# Altium project GameBoard_V1I1.PrjPcb (part 3 of 20)

## Sheet [08] - CPU - SPI, UART.SchDoc
size A2; DocumentNumber: 8; SheetNumber: 8; SheetTotal: 32
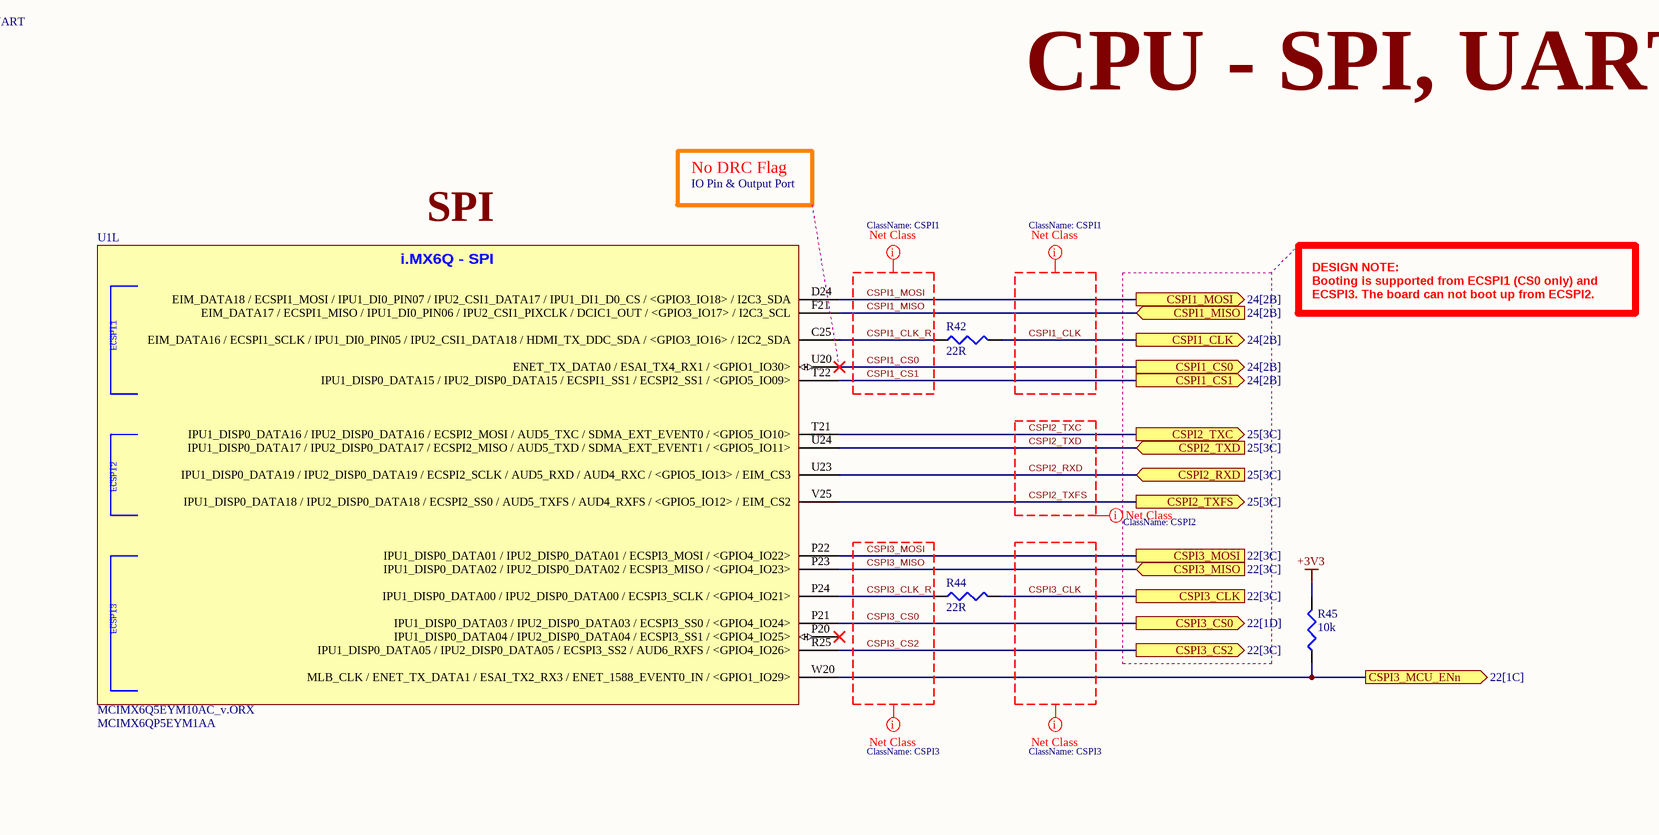
[diagram p16: [08] - CPU - SPI, UART.SchDoc, top left]
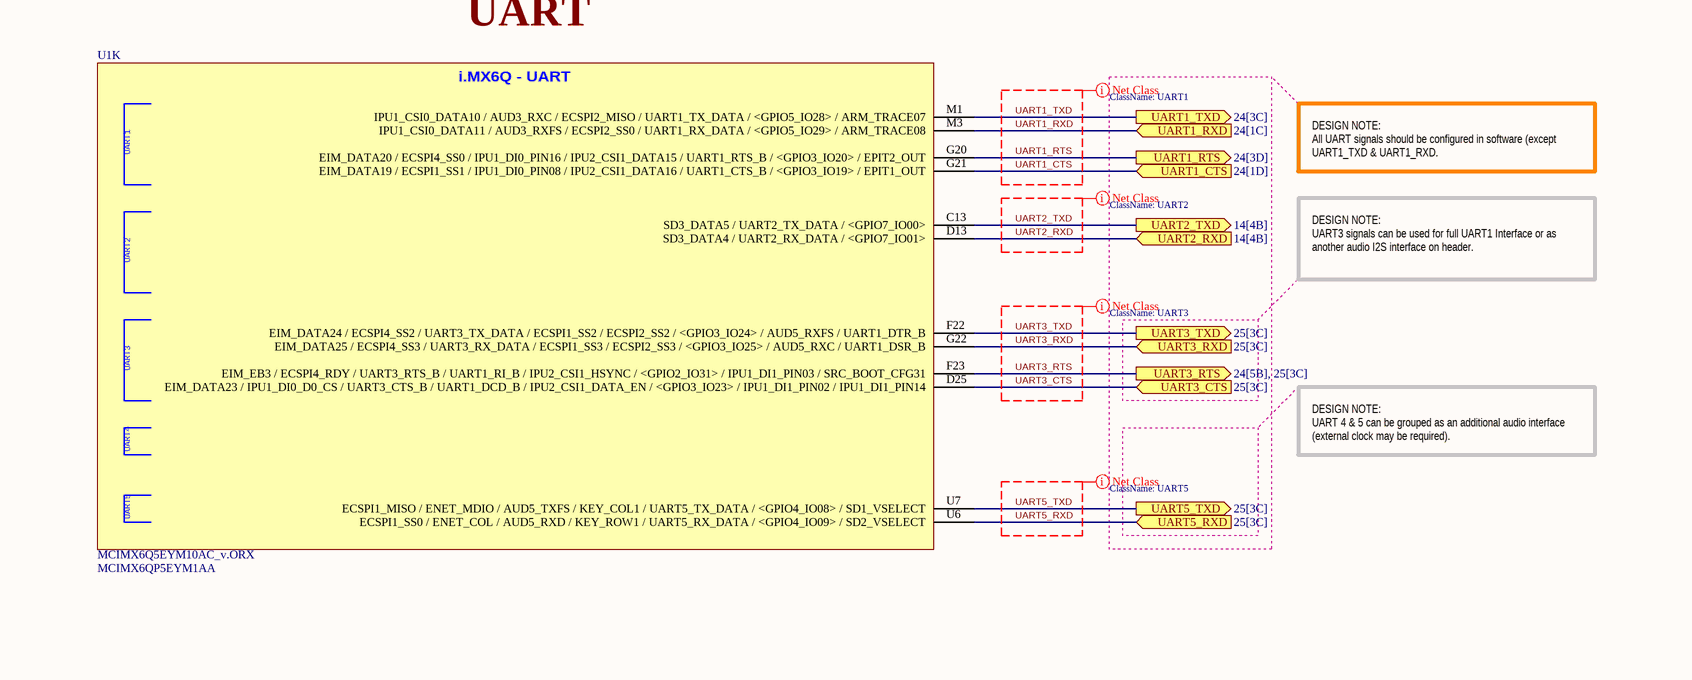
[diagram p17: [08] - CPU - SPI, UART.SchDoc, bottom left]
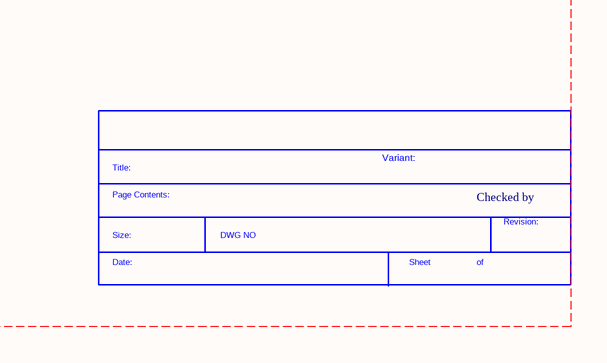
[diagram p18: [08] - CPU - SPI, UART.SchDoc, bottom right]

### Parts
(Parts that share a designator on the sheet are numbered #1, #2 ... from top to bottom, then left to right.)
*#8  SDTitleBlock  (value not drawn)  (graphical)
R42  22R  [R0402]
R44  22R  [R0402]
R45  10k  [R0402]
U1  MCIMX6Q5EYM10AC_v.ORX  Supplier Part Number 2: MCIMX6QP5EYM1AA  [PBGA624]  (parts K,L of 23)

### Ports
CSPI1_CLK (out, see 24[2B]), CSPI1_CS0 (out, see 24[2B]), CSPI1_CS1 (out, see 24[2B]), CSPI1_MISO (in, see 24[2B]), CSPI1_MOSI (out, see 24[2B]), CSPI2_RXD (in, see 25[3C]), CSPI2_TXC (out, see 25[3C]), CSPI2_TXD (in, see 25[3C]), CSPI2_TXFS (out, see 25[3C]), CSPI3_CLK (see 22[3C]), CSPI3_CS0 (out, see 22[1D]), CSPI3_CS2 (out, see 22[3C]), CSPI3_MCU_ENn (out, see 22[1C]), CSPI3_MISO (in, see 22[3C]), CSPI3_MOSI (see 22[3C]), UART1_CTS (in, see 24[1D]), UART1_RTS (out, see 24[3D]), UART1_RXD (in, see 24[1C]), UART1_TXD (out, see 24[3C]), UART2_RXD (in, see 14[4B]), UART2_TXD (out, see 14[4B]), UART3_CTS (in, see 25[3C]), UART3_RTS (out, see 24[5B], 25[3C]), UART3_RXD (in, see 25[3C]), UART3_TXD (out, see 25[3C]), UART5_RXD (in, see 25[3C]), UART5_TXD (out, see 25[3C])

### Nets
+3V3: R45.2
CSPI1_CLK: R42.2 ; port CSPI1_CLK
CSPI1_CLK_R: R42.1 U1.C25(EIM_DATA16_/_ECSPI1_SCLK_/_IPU1_DI0_PIN05_/_IPU2_CSI1_DATA18_/_HDMI_TX_DDC_SDA_/_<GPIO3_IO16>_/_I2C2_SDA)
CSPI1_CS0: U1.U20(ENET_TX_DATA0_/_ESAI_TX4_RX1_/_<GPIO1_IO30>) ; port CSPI1_CS0
CSPI1_CS1: U1.T22(IPU1_DISP0_DATA15_/_IPU2_DISP0_DATA15_/_ECSPI1_SS1_/_ECSPI2_SS1_/_<GPIO5_IO09>) ; port CSPI1_CS1
CSPI1_MISO: U1.F21(EIM_DATA17_/_ECSPI1_MISO_/_IPU1_DI0_PIN06_/_IPU2_CSI1_PIXCLK_/_DCIC1_OUT_/_<GPIO3_IO17>_/_I2C3_SCL) ; port CSPI1_MISO
CSPI1_MOSI: U1.D24(EIM_DATA18_/_ECSPI1_MOSI_/_IPU1_DI0_PIN07_/_IPU2_CSI1_DATA17_/_IPU1_DI1_D0_CS_/_<GPIO3_IO18>_/_I2C3_SDA) ; port CSPI1_MOSI
CSPI2_RXD: U1.U23(IPU1_DISP0_DATA19_/_IPU2_DISP0_DATA19_/_ECSPI2_SCLK_/_AUD5_RXD_/_AUD4_RXC_/_<GPIO5_IO13>_/_EIM_CS3) ; port CSPI2_RXD
CSPI2_TXC: U1.T21(IPU1_DISP0_DATA16_/_IPU2_DISP0_DATA16_/_ECSPI2_MOSI_/_AUD5_TXC_/_SDMA_EXT_EVENT0_/_<GPIO5_IO10>) ; port CSPI2_TXC
CSPI2_TXD: U1.U24(IPU1_DISP0_DATA17_/_IPU2_DISP0_DATA17_/_ECSPI2_MISO_/_AUD5_TXD_/_SDMA_EXT_EVENT1_/_<GPIO5_IO11>) ; port CSPI2_TXD
CSPI2_TXFS: U1.V25(IPU1_DISP0_DATA18_/_IPU2_DISP0_DATA18_/_ECSPI2_SS0_/_AUD5_TXFS_/_AUD4_RXFS_/_<GPIO5_IO12>_/_EIM_CS2) ; port CSPI2_TXFS
CSPI3_CLK: R44.2 ; port CSPI3_CLK
CSPI3_CLK_R: R44.1 U1.P24(IPU1_DISP0_DATA00_/_IPU2_DISP0_DATA00_/_ECSPI3_SCLK_/_<GPIO4_IO21>)
CSPI3_CS0: U1.P21(IPU1_DISP0_DATA03_/_IPU2_DISP0_DATA03_/_ECSPI3_SS0_/_<GPIO4_IO24>) ; port CSPI3_CS0
CSPI3_CS2: U1.R25(IPU1_DISP0_DATA05_/_IPU2_DISP0_DATA05_/_ECSPI3_SS2_/_AUD6_RXFS_/_<GPIO4_IO26>) ; port CSPI3_CS2
CSPI3_MCU_ENn: R45.1 U1.W20(MLB_CLK_/_ENET_TX_DATA1_/_ESAI_TX2_RX3_/_ENET_1588_EVENT0_IN_/_<GPIO1_IO29>) ; port CSPI3_MCU_ENn
CSPI3_MISO: U1.P23(IPU1_DISP0_DATA02_/_IPU2_DISP0_DATA02_/_ECSPI3_MISO_/_<GPIO4_IO23>) ; port CSPI3_MISO
CSPI3_MOSI: U1.P22(IPU1_DISP0_DATA01_/_IPU2_DISP0_DATA01_/_ECSPI3_MOSI_/_<GPIO4_IO22>) ; port CSPI3_MOSI
UART1_CTS: U1.G21(EIM_DATA19_/_ECSPI1_SS1_/_IPU1_DI0_PIN08_/_IPU2_CSI1_DATA16_/_UART1_CTS_B_/_<GPIO3_IO19>_/_EPIT1_OUT) ; port UART1_CTS
UART1_RTS: U1.G20(EIM_DATA20_/_ECSPI4_SS0_/_IPU1_DI0_PIN16_/_IPU2_CSI1_DATA15_/_UART1_RTS_B_/_<GPIO3_IO20>_/_EPIT2_OUT) ; port UART1_RTS
UART1_RXD: U1.M3(IPU1_CSI0_DATA11_/_AUD3_RXFS_/_ECSPI2_SS0_/_UART1_RX_DATA_/_<GPIO5_IO29>_/_ARM_TRACE08) ; port UART1_RXD
UART1_TXD: U1.M1(IPU1_CSI0_DATA10_/_AUD3_RXC_/_ECSPI2_MISO_/_UART1_TX_DATA_/_<GPIO5_IO28>_/_ARM_TRACE07) ; port UART1_TXD
UART2_RXD: U1.D13(SD3_DATA4_/_UART2_RX_DATA_/_<GPIO7_IO01>) ; port UART2_RXD
UART2_TXD: U1.C13(SD3_DATA5_/_UART2_TX_DATA_/_<GPIO7_IO00>) ; port UART2_TXD
UART3_CTS: U1.D25(EIM_DATA23_/_IPU1_DI0_D0_CS_/_UART3_CTS_B_/_UART1_DCD_B_/_IPU2_CSI1_DATA_EN_/_<GPIO3_IO23>_/_IPU1_DI1_PIN02_/_IPU1_DI1_PIN14) ; port UART3_CTS
UART3_RTS: U1.F23(EIM_EB3_/_ECSPI4_RDY_/_UART3_RTS_B_/_UART1_RI_B_/_IPU2_CSI1_HSYNC_/_<GPIO2_IO31>_/_IPU1_DI1_PIN03_/_SRC_BOOT_CFG31) ; port UART3_RTS
UART3_RXD: U1.G22(EIM_DATA25_/_ECSPI4_SS3_/_UART3_RX_DATA_/_ECSPI1_SS3_/_ECSPI2_SS3_/_<GPIO3_IO25>_/_AUD5_RXC_/_UART1_DSR_B) ; port UART3_RXD
UART3_TXD: U1.F22(EIM_DATA24_/_ECSPI4_SS2_/_UART3_TX_DATA_/_ECSPI1_SS2_/_ECSPI2_SS2_/_<GPIO3_IO24>_/_AUD5_RXFS_/_UART1_DTR_B) ; port UART3_TXD
UART5_RXD: U1.U6(ECSPI1_SS0_/_ENET_COL_/_AUD5_RXD_/_KEY_ROW1_/_UART5_RX_DATA_/_<GPIO4_IO09>_/_SD2_VSELECT) ; port UART5_RXD
UART5_TXD: U1.U7(ECSPI1_MISO_/_ENET_MDIO_/_AUD5_TXFS_/_KEY_COL1_/_UART5_TX_DATA_/_<GPIO4_IO08>_/_SD1_VSELECT) ; port UART5_TXD

Not connected (* = marked no-connect by the designer): U1 P20(IPU1_DISP0_DATA04_/_IPU2_DISP0_DATA04_/_ECSPI3_SS1_/_<GPIO4_IO25>)*

### Layout directives
net class UART1: UART1_CTS, UART1_RTS, UART1_RXD, UART1_TXD
net class CSPI1: CSPI1_CLK, CSPI1_CLK_R, CSPI1_CS0, CSPI1_CS1, CSPI1_MISO, CSPI1_MOSI
net class CSPI3: CSPI3_CLK, CSPI3_CLK_R, CSPI3_CS0, CSPI3_CS2, CSPI3_MISO, CSPI3_MOSI
net class UART3: UART3_CTS, UART3_RTS, UART3_RXD, UART3_TXD
net class CSPI2: CSPI2_RXD, CSPI2_TXC, CSPI2_TXD, CSPI2_TXFS
net class UART5: UART5_RXD, UART5_TXD
net class UART2: UART2_RXD, UART2_TXD
net class [08] - CPU - SPI/UART: +3V3, CSPI1_CLK, CSPI1_CLK_R, CSPI1_CS0, CSPI1_CS1, CSPI1_MISO, CSPI1_MOSI, CSPI2_RXD, CSPI2_TXC, CSPI2_TXD, CSPI2_TXFS, CSPI3_CLK, CSPI3_CLK_R, CSPI3_CS0, CSPI3_CS2, CSPI3_MISO, CSPI3_MOSI, UART1_CTS, UART1_RTS, UART1_RXD, UART1_TXD, UART2_RXD, UART2_TXD, UART3_CTS, UART3_RTS, UART3_RXD, UART3_TXD, UART5_RXD, UART5_TXD

### Notes on the sheet
- CPU - SPI, UART
- No DRC Flag
- IO Pin & Output Port
- SPI
- DESIGN NOTE:
  Booting is supported from ECSPI1 (CS0 only) and ECSPI3. The board can not boot up from ECSPI2.
- UART
- DESIGN NOTE:
  All UART signals should be configured in software (except UART1_TXD & UART1_RXD.
- DESIGN NOTE:
  UART3 signals can be used for full UART1 Interface or as another audio I2S interface on header.
- DESIGN NOTE:
  UART 4 & 5 can be grouped as an additional audio interface (external clock may be required).
- Variant:
- Checked by
- (in symbol MCIMX6Q5EYM10AC_v.ORX, part K) i.MX6Q - UART; UART1; UART2; UART3; UART4; UART5
- (in symbol MCIMX6Q5EYM10AC_v.ORX, part L) i.MX6Q - SPI; ECSPI1; ECSPI2; ECSPI3
- (in symbol SDTitleBlock) Title:; Page Contents:; Revision:; Size:; DWG NO; Date:; Sheet; of

### Library data of the parts
R42 R44 = RC0402FR-0722RL: RES 22.0 OHM 1/16W 1% 0402 SMD; Manufacturer: Yageo; Resistance (Ohms): 22; Power (Watts): 0.063W, 1/16W; .Checked PCB: used; Temperature Coefficient: ±100ppm/°C; Category: Resistors; Supplier Part Number: 311-22.0LRCT-ND; Manufacturer Part Number: RC0402FR-0722RL; Package / Case: 0402 (1005 Metric); Price 1k [$]: 0.01421; Tolerance: ±1%; Value: 22R; .Checked SCH: used; Supplier: Digikey; Supplier 1: Digi-Key; Supplier Part Number 1: 311-22.0LRCT-ND; RoHS: RoHS Compliant; Stock 1: 943800; Pricing 1: 10=0.014, 50=0.0104, 100=0.0079, 250=0.00584, 500=0.00432, 1000=0.00288 (USD); Composition: Thick Film; Features: -; Size / Dimension: 0.039" L x 0.020" W (1.00mm x 0.50mm); Height: 0.016" (0.40mm); Number of Terminations: 2; Packaging: Cut Tape (CT); ComponentLink1URL: http://www.yageo.com/documents/recent/PYu-RC0402_51_RoHS_L_6.pdf; ComponentLink1Description: http://www.yageo.com/documents/recent/PYu-RC0402_51_RoHS_L_6.pdf
R45 = RC0402FR-0710KL: RES 10.0K OHM 1/16W 1% 0402 SMD; Manufacturer: Yageo; Power (Watts): 0.063W, 1/16W; .Checked PCB: used; Temperature Coefficient: ±100ppm/°C; Category: Resistors; Supplier Part Number: 311-10.0KLRCT-ND; Manufacturer Part Number: RC0402FR-0710KL; Package / Case: 0402 (1005 Metric); Price 1k [$]: 0.01421; Resistance (Ohms): 10K; Tolerance: ±1%; Value: 10k; .Checked SCH: used; Supplier: Digikey; Supplier 1: Digi-Key; Supplier Part Number 1: 311-10.0KLRCT-ND; RoHS: RoHS Compliant; Stock 1: 2916495; Pricing 1: 10=0.014, 50=0.0104, 100=0.0079, 250=0.00584, 500=0.00432, 1000=0.00288 (USD); Composition: Thick Film; Features: -; Size / Dimension: 0.039" L x 0.020" W (1.00mm x 0.50mm); Height: 0.016" (0.40mm); Number of Terminations: 2; Packaging: Cut Tape (CT); ComponentLink1URL: http://www.yageo.com/documents/recent/PYu-RC0402_51_RoHS_L_6.pdf; ComponentLink1Description: http://www.yageo.com/documents/recent/PYu-RC0402_51_RoHS_L_6.pdf
U1 = MCIMX6Q5EYM10AC_v.ORX: IC MCU 32BIT ARM QUAD 624FCBGA; Manufacturer: Freescale Semiconductor; Core Processor: ARM® Cortex™-A9; Core Size: 32-Bit Quad-Core; Speed: 1.0GHz; Connectivity: CAN, EBI/EMI, ESAI, Ethernet, GPMI, I2C, MMC/SD, PCI, SATA, SPI, UART, USB, USB OTG; Peripherals: DMA, HDMI, I2S/SSI/AC97, MIPI CSI, MIMI DSI, MIPI HIS, PWM, WDT; Number of I /O: 224; Program Memory Type: External Program Memory; RAM Size: 256K x 8; Voltage - Supply (Vcc/Vdd): 0.925 V ~ 1.5 V; Oscillator Type: Internal; .Creator: MM; .Checked PCB: used; Supplier 1: Digi-Key; Manufacturer Part Number: MCIMX6Q5EYM10AC; RoHS: RoHS Compliant; Category: Integrated Circuits (ICs); Stock 1: 0; Pricing 1: 1=54.98, 10=51.922, 25=48.868, 100=30.5424 (USD); Program Memory Size: -; EEPROM Size: -; Data Converters: -; Operating Temperature: -20°C ~ 105°C; Package / Case: 624-FBGA, FCBGA; Packaging: Tray; ComponentLink1URL: http://cache.freescale.com/files/32bit/doc/data_sheet/IMX6DQCEC.pdf; ComponentLink1Description: Data Sheet; Supplier Part Number 1: MCIMX6Q5EYM10AC-ND; .Checked SCH: used; ComponentLink2Description: User Guide; ComponentLink2URL: file:///C:/Users/mbeach/Downloads/i.MX_Linux_User's_Guide.pdf; Supplier 2: Arrow

## Sheet [10] - CPU - GPIO, PWM, LEDS, BUTTONS.SchDoc
size A2; DocumentNumber: 10; SheetNumber: 10; SheetTotal: 32
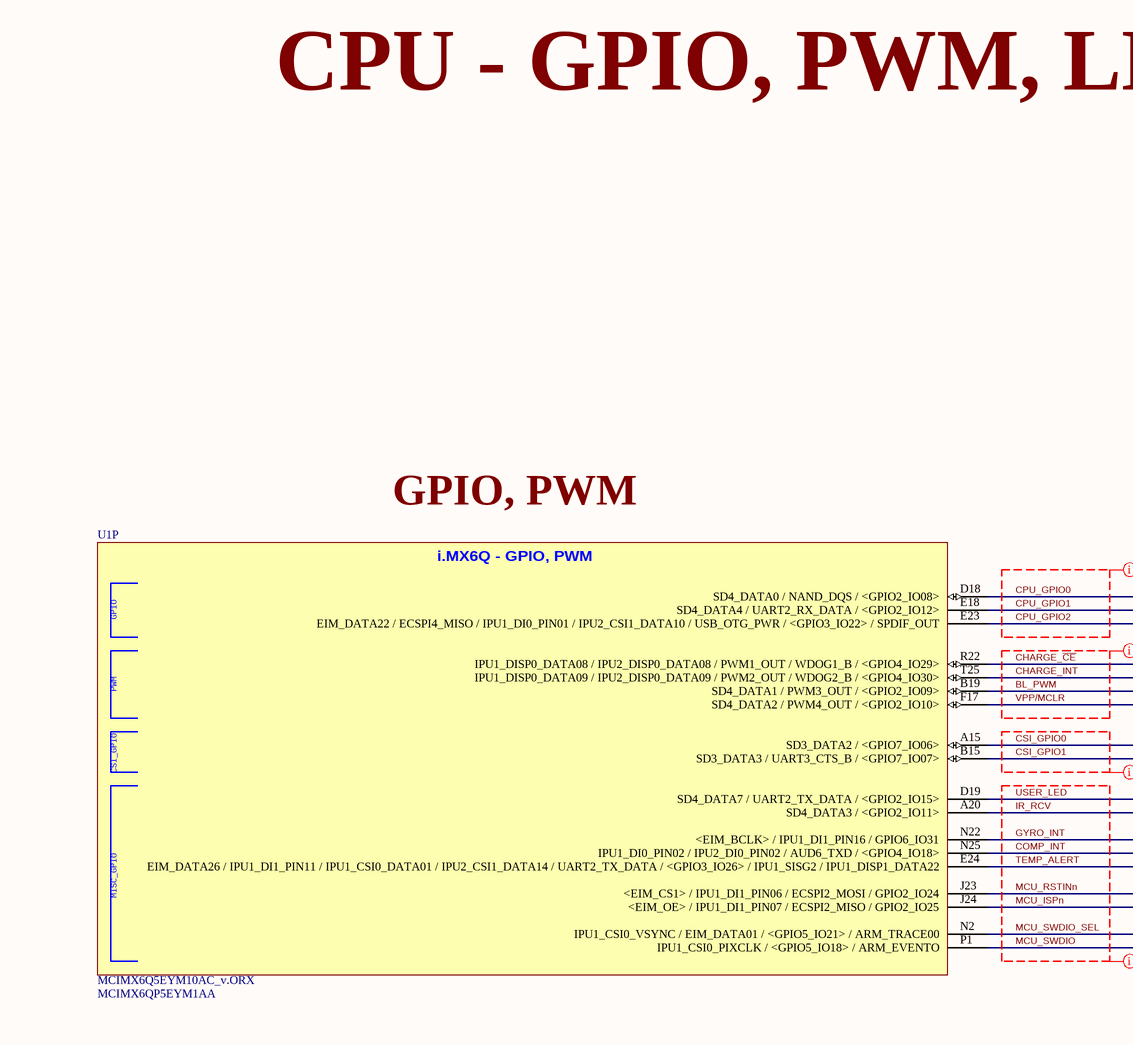
[diagram p19: [10] - CPU - GPIO, PWM, LEDS, BUTTONS.SchDoc, top left]
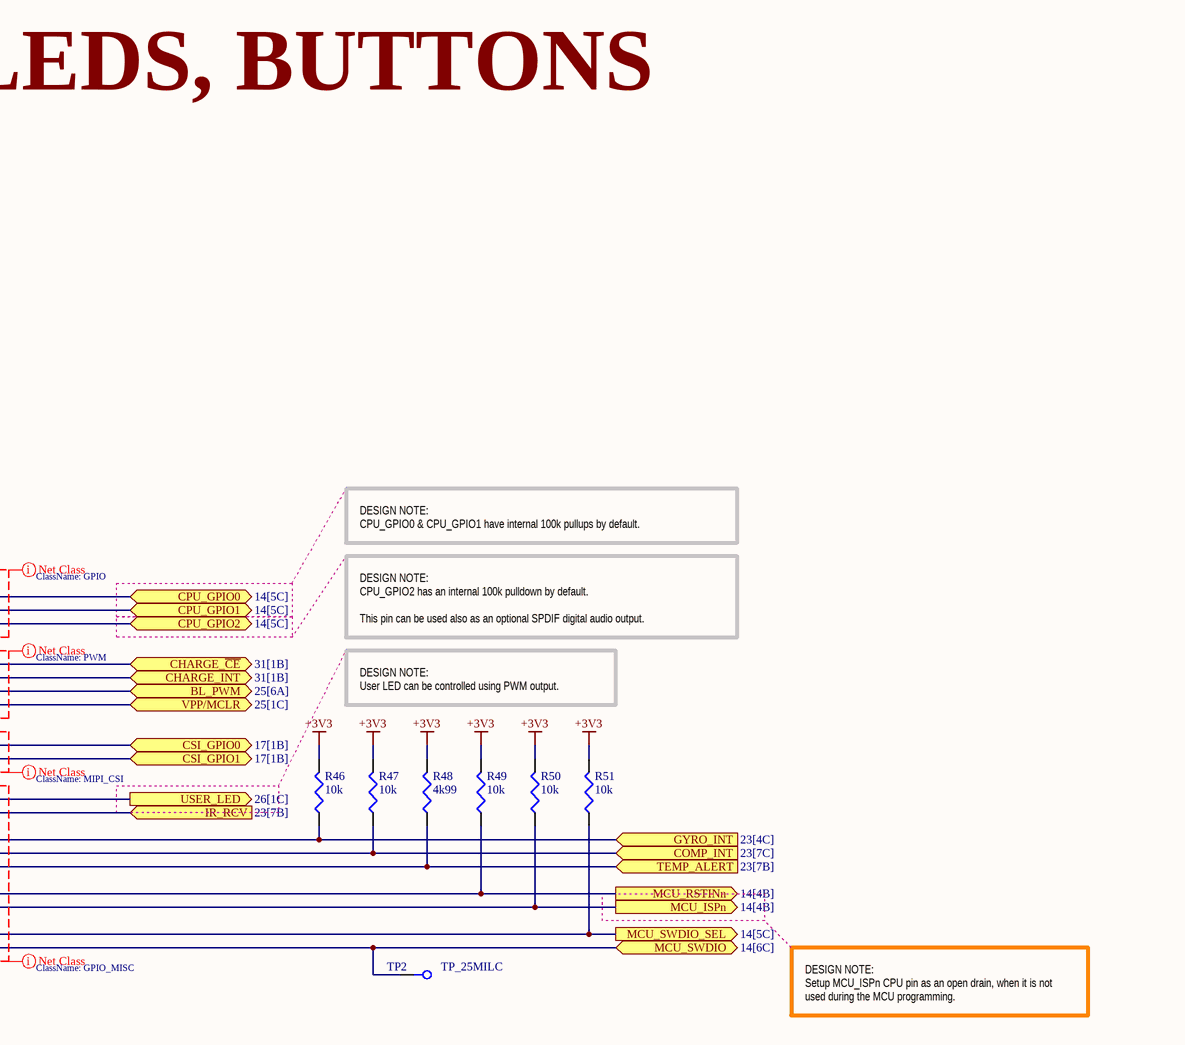
[diagram p20: [10] - CPU - GPIO, PWM, LEDS, BUTTONS.SchDoc, top right]
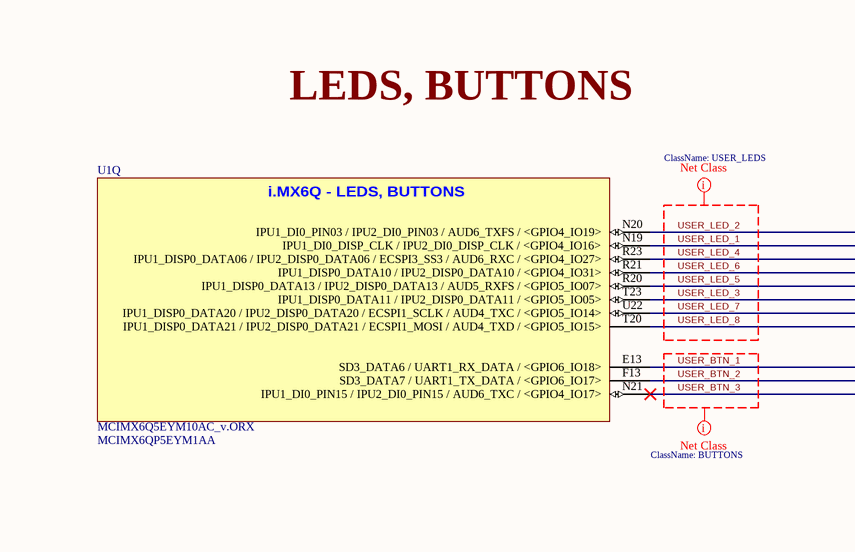
[diagram p21: [10] - CPU - GPIO, PWM, LEDS, BUTTONS.SchDoc, bottom left]
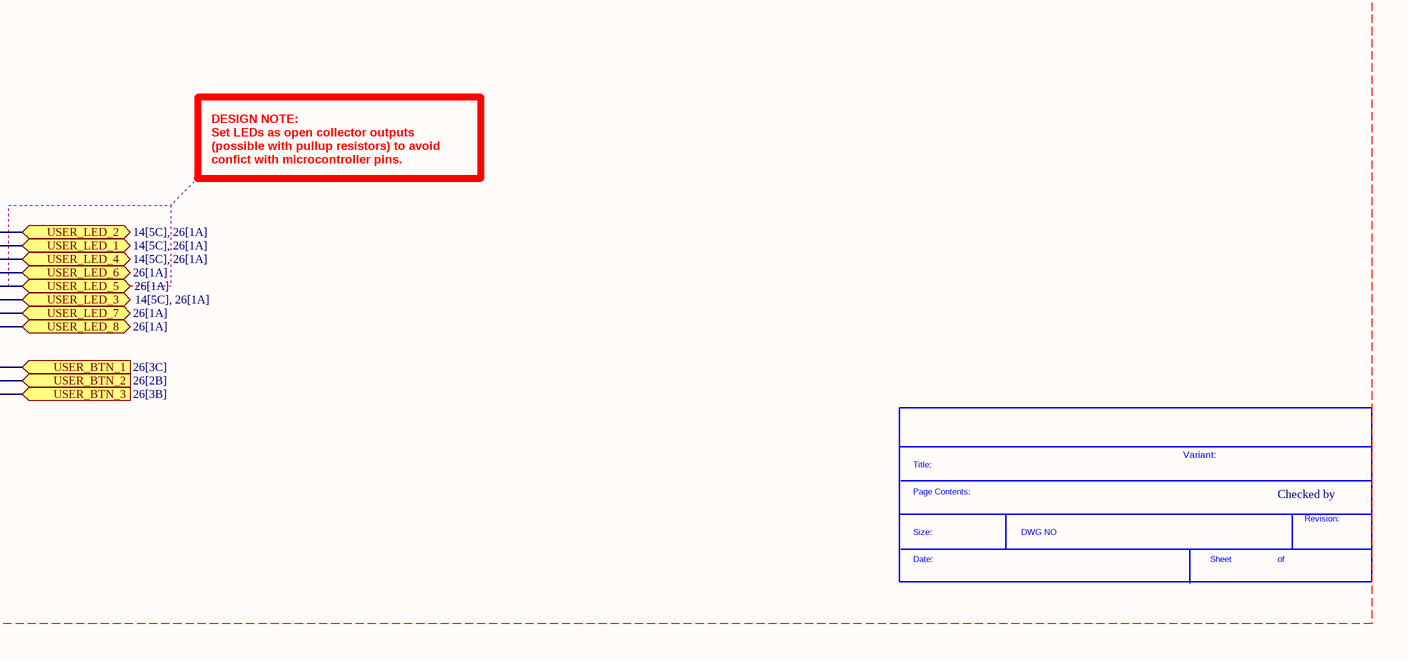
[diagram p22: [10] - CPU - GPIO, PWM, LEDS, BUTTONS.SchDoc, bottom right]

### Parts
(Parts that share a designator on the sheet are numbered #1, #2 ... from top to bottom, then left to right.)
*#9  SDTitleBlock  (value not drawn)  (graphical)
R46  10k  [R0402]
R47  10k  [R0402]
R48  4k99  [R0402]
R49  10k  [R0402]
R50  10k  [R0402]
R51  10k  [R0402]
TP2  TP_25MILC  [TP_25C]  (no BOM)
U1  MCIMX6Q5EYM10AC_v.ORX  Supplier Part Number 2: MCIMX6QP5EYM1AA  [PBGA624]  (parts P,Q of 23)

### Ports
BL_PWM (bidir, see 25[6A]), CHARGE_INT (bidir, see 31[1B]), CHARGE_~{CE} (bidir, see 31[1B]), COMP_INT (in, see 23[7C]), CPU_GPIO0 (bidir, see 14[5C]), CPU_GPIO1 (bidir, see 14[5C]), CPU_GPIO2 (bidir, see 14[5C]), CSI_GPIO0 (bidir, see 17[1B]), CSI_GPIO1 (bidir, see 17[1B]), GYRO_INT (in, see 23[4C]), IR_RCV (in, see 23[7B]), MCU_ISPn (out, see 14[4B]), MCU_RSTINn (out, see 14[4B]), MCU_SWDIO (bidir, see 14[6C]), MCU_SWDIO_SEL (out, see 14[5C]), TEMP_ALERT (in, see 23[7B]), USER_BTN_1 (in, see 26[3C]), USER_BTN_2 (in, see 26[2B]), USER_BTN_3 (in, see 26[3B]), USER_LED (out, see 26[1C]), USER_LED_1 (bidir, see 14[5C], 26[1A]), USER_LED_2 (bidir, see 14[5C], 26[1A]), USER_LED_3 (bidir, see 14[5C], 26[1A]), USER_LED_4 (bidir, see 14[5C], 26[1A]), USER_LED_5 (bidir, see 26[1A]), USER_LED_6 (bidir, see 26[1A]), USER_LED_7 (bidir, see 26[1A]), USER_LED_8 (bidir, see 26[1A]), VPP/MCLR (bidir, see 25[1C])

### Nets
+3V3: R46.2 R47.2 R48.2 R49.2 R50.2 R51.2
BL_PWM: U1.B19(SD4_DATA1_/_PWM3_OUT_/_<GPIO2_IO09>) ; port BL_PWM
CHARGE_~{CE}: U1.R22(IPU1_DISP0_DATA08_/_IPU2_DISP0_DATA08_/_PWM1_OUT_/_WDOG1_B_/_<GPIO4_IO29>) ; port CHARGE_~{CE}
CHARGE_INT: U1.T25(IPU1_DISP0_DATA09_/_IPU2_DISP0_DATA09_/_PWM2_OUT_/_WDOG2_B_/_<GPIO4_IO30>) ; port CHARGE_INT
COMP_INT: R47.1 U1.N25(IPU1_DI0_PIN02_/_IPU2_DI0_PIN02_/_AUD6_TXD_/_<GPIO4_IO18>) ; port COMP_INT
CPU_GPIO0: U1.D18(SD4_DATA0_/_NAND_DQS_/_<GPIO2_IO08>) ; port CPU_GPIO0
CPU_GPIO1: U1.E18(SD4_DATA4_/_UART2_RX_DATA_/_<GPIO2_IO12>) ; port CPU_GPIO1
CPU_GPIO2: U1.E23(EIM_DATA22_/_ECSPI4_MISO_/_IPU1_DI0_PIN01_/_IPU2_CSI1_DATA10_/_USB_OTG_PWR_/_<GPIO3_IO22>_/_SPDIF_OUT) ; port CPU_GPIO2
CSI_GPIO0: U1.A15(SD3_DATA2_/_<GPIO7_IO06>) ; port CSI_GPIO0
CSI_GPIO1: U1.B15(SD3_DATA3_/_UART3_CTS_B_/_<GPIO7_IO07>) ; port CSI_GPIO1
GYRO_INT: R46.1 U1.N22(<EIM_BCLK>_/_IPU1_DI1_PIN16_/_GPIO6_IO31) ; port GYRO_INT
IR_RCV: U1.A20(SD4_DATA3_/_<GPIO2_IO11>) ; port IR_RCV
MCU_ISPn: R50.1 U1.J24(<EIM_OE>_/_IPU1_DI1_PIN07_/_ECSPI2_MISO_/_GPIO2_IO25) ; port MCU_ISPn
MCU_RSTINn: R49.1 U1.J23(<EIM_CS1>_/_IPU1_DI1_PIN06_/_ECSPI2_MOSI_/_GPIO2_IO24) ; port MCU_RSTINn
MCU_SWDIO: TP2.1 U1.P1(IPU1_CSI0_PIXCLK_/_<GPIO5_IO18>_/_ARM_EVENTO) ; port MCU_SWDIO
MCU_SWDIO_SEL: R51.1 U1.N2(IPU1_CSI0_VSYNC_/_EIM_DATA01_/_<GPIO5_IO21>_/_ARM_TRACE00) ; port MCU_SWDIO_SEL
TEMP_ALERT: R48.1 U1.E24(EIM_DATA26_/_IPU1_DI1_PIN11_/_IPU1_CSI0_DATA01_/_IPU2_CSI1_DATA14_/_UART2_TX_DATA_/_<GPIO3_IO26>_/_IPU1_SISG2_/_IPU1_DISP1_DATA22) ; port TEMP_ALERT
USER_BTN_1: U1.E13(SD3_DATA6_/_UART1_RX_DATA_/_<GPIO6_IO18>) ; port USER_BTN_1
USER_BTN_2: U1.F13(SD3_DATA7_/_UART1_TX_DATA_/_<GPIO6_IO17>) ; port USER_BTN_2
USER_BTN_3: U1.N21(IPU1_DI0_PIN15_/_IPU2_DI0_PIN15_/_AUD6_TXC_/_<GPIO4_IO17>) ; port USER_BTN_3
USER_LED: U1.D19(SD4_DATA7_/_UART2_TX_DATA_/_<GPIO2_IO15>) ; port USER_LED
USER_LED_1: U1.N19(IPU1_DI0_DISP_CLK_/_IPU2_DI0_DISP_CLK_/_<GPIO4_IO16>) ; port USER_LED_1
USER_LED_2: U1.N20(IPU1_DI0_PIN03_/_IPU2_DI0_PIN03_/_AUD6_TXFS_/_<GPIO4_IO19>) ; port USER_LED_2
USER_LED_3: U1.T23(IPU1_DISP0_DATA11_/_IPU2_DISP0_DATA11_/_<GPIO5_IO05>) ; port USER_LED_3
USER_LED_4: U1.R23(IPU1_DISP0_DATA06_/_IPU2_DISP0_DATA06_/_ECSPI3_SS3_/_AUD6_RXC_/_<GPIO4_IO27>) ; port USER_LED_4
USER_LED_5: U1.R20(IPU1_DISP0_DATA13_/_IPU2_DISP0_DATA13_/_AUD5_RXFS_/_<GPIO5_IO07>) ; port USER_LED_5
USER_LED_6: U1.R21(IPU1_DISP0_DATA10_/_IPU2_DISP0_DATA10_/_<GPIO4_IO31>) ; port USER_LED_6
USER_LED_7: U1.U22(IPU1_DISP0_DATA20_/_IPU2_DISP0_DATA20_/_ECSPI1_SCLK_/_AUD4_TXC_/_<GPIO5_IO14>) ; port USER_LED_7
USER_LED_8: U1.T20(IPU1_DISP0_DATA21_/_IPU2_DISP0_DATA21_/_ECSPI1_MOSI_/_AUD4_TXD_/_<GPIO5_IO15>) ; port USER_LED_8
VPP/MCLR: U1.F17(SD4_DATA2_/_PWM4_OUT_/_<GPIO2_IO10>) ; port VPP/MCLR

### Layout directives
net class PWM: BL_PWM, CHARGE_INT, CHARGE_~{CE}, VPP/MCLR
net class GPIO: CPU_GPIO0, CPU_GPIO1, CPU_GPIO2
net class GPIO_MISC: COMP_INT, GYRO_INT, IR_RCV, MCU_ISPn, MCU_RSTINn, MCU_SWDIO, MCU_SWDIO_SEL, TEMP_ALERT, USER_LED
net class USER_LEDS: USER_LED_1, USER_LED_2, USER_LED_3, USER_LED_4, USER_LED_5, USER_LED_6, USER_LED_7, USER_LED_8
net class BUTTONS: USER_BTN_1, USER_BTN_2, USER_BTN_3
net class MIPI_CSI: CSI_GPIO0, CSI_GPIO1
net class [10] - CPU - GPIO/PWM/LEDS/BUTTONS: +3V3, BL_PWM, CHARGE_INT, CHARGE_~{CE}, COMP_INT, CPU_GPIO0, CPU_GPIO1, CPU_GPIO2, CSI_GPIO0, CSI_GPIO1, GYRO_INT, IR_RCV, MCU_ISPn, MCU_RSTINn, MCU_SWDIO, MCU_SWDIO_SEL, TEMP_ALERT, USER_BTN_1, USER_BTN_2, USER_BTN_3, USER_LED, USER_LED_1, USER_LED_2, USER_LED_3, USER_LED_4, USER_LED_5, USER_LED_6, USER_LED_7, USER_LED_8, VPP/MCLR

### Notes on the sheet
- CPU - GPIO, PWM, LEDS, BUTTONS
- GPIO, PWM
- DESIGN NOTE:
  CPU_GPIO0 & CPU_GPIO1 have internal 100k pullups by default.
- DESIGN NOTE:
  CPU_GPIO2 has an internal 100k pulldown by default.
  This pin can be used also as an optional SPDIF digital audio output.
- DESIGN NOTE:
  User LED can be controlled using PWM output.
- DESIGN NOTE:
  Setup MCU_ISPn CPU pin as an open drain, when it is not used during the MCU programming.
- LEDS, BUTTONS
- DESIGN NOTE:
  Set LEDs as open collector outputs (possible with pullup resistors) to avoid confict with microcontroller pins.
- Variant:
- Checked by
- (in symbol MCIMX6Q5EYM10AC_v.ORX, part P) i.MX6Q - GPIO, PWM; GPIO; PWM; CSI_GPIO; MISC_GPIO
- (in symbol MCIMX6Q5EYM10AC_v.ORX, part Q) i.MX6Q - LEDS, BUTTONS
- (in symbol SDTitleBlock) Title:; Page Contents:; Revision:; Size:; DWG NO; Date:; Sheet; of

### Library data of the parts
R46 R47 R49-R51 = RC0402FR-0710KL: as R45 on sheet [08] - CPU - SPI, UART; Category: Resistors; Supplier Part Number: 311-10.0KLRCT-ND; Manufacturer Part Number: RC0402FR-0710KL; Package / Case: 0402 (1005 Metric); Price 1k [$]: 0.01421; Resistance (Ohms): 10K; Tolerance: ±1%; Value: 10k; .Checked SCH: used; Supplier: Digikey; Supplier 1: Digi-Key; Supplier Part Number 1: 311-10.0KLRCT-ND; RoHS: RoHS Compliant; Stock 1: 2916495; Pricing 1: 10=0.014, 50=0.0104, 100=0.0079, 250=0.00584, 500=0.00432, 1000=0.00288 (USD); Composition: Thick Film; Features: -; Size / Dimension: 0.039" L x 0.020" W (1.00mm x 0.50mm); Height: 0.016" (0.40mm); Number of Terminations: 2; Packaging: Cut Tape (CT); ComponentLink1URL: http://www.yageo.com/documents/recent/PYu-RC0402_51_RoHS_L_6.pdf; ComponentLink1Description: http://www.yageo.com/documents/recent/PYu-RC0402_51_RoHS_L_6.pdf
R48 = RMCF0402FT4K99: RES TF 4.99K OHM 1% 1/16W 0402; Manufacturer: Stackpole Electronics Inc; Power (Watts): 0.063W, 1/16W; .Checked PCB: used; Temperature Coefficient: ±100ppm/°C; Category: Resistors; Supplier Part Number: RMCF0402FT4K99CT-ND; Manufacturer Part Number: RMCF0402FT4K99; Package / Case: 0402 (1005 Metric); Price 1k [$]: 0.00384; Resistance (Ohms): 4.99K; Tolerance: ±1%; Value: 4k99; .Checked SCH: used; Supplier: Digikey; Supplier 1: Digi-Key; Supplier Part Number 1: RMCF0402FT4K99CT-ND; RoHS: RoHS Compliant; Stock 1: 48509; Pricing 1: 1=0.04, 10=0.025, 50=0.0138, 100=0.0105, 250=0.0078, 500=0.00576, 1000=0.00384 (USD); Composition: Thick Film; Features: -; Size / Dimension: 0.039" L x 0.020" W (1.00mm x 0.50mm); Height: 0.016" (0.40mm); Number of Terminations: 2; Packaging: Cut Tape (CT); ComponentLink1URL: http://www.seielect.com/Catalog/SEI-RMCF.pdf; ComponentLink1Description: http://www.seielect.com/Catalog/SEI-RMCF.pdf
TP2 = TP_25MILC: Test Point 25mil; .Checked PCB: used
U1 = MCIMX6Q5EYM10AC_v.ORX: as U1 on sheet [08] - CPU - SPI, UART; Supplier 1: Digi-Key; Manufacturer Part Number: MCIMX6Q5EYM10AC; RoHS: RoHS Compliant; Category: Integrated Circuits (ICs); Stock 1: 0; Pricing 1: 1=54.98, 10=51.922, 25=48.868, 100=30.5424 (USD); Program Memory Size: -; EEPROM Size: -; Data Converters: -; Operating Temperature: -20°C ~ 105°C; Package / Case: 624-FBGA, FCBGA; Packaging: Tray; ComponentLink1URL: http://cache.freescale.com/files/32bit/doc/data_sheet/IMX6DQCEC.pdf; ComponentLink1Description: Data Sheet; Supplier Part Number 1: MCIMX6Q5EYM10AC-ND; .Checked SCH: used; ComponentLink2Description: User Guide; ComponentLink2URL: file:///C:/Users/mbeach/Downloads/i.MX_Linux_User's_Guide.pdf; Supplier 2: Arrow

## Sheet [09] - CPU - SD, AUDIO, I2C, CAN.SchDoc
size A2; DocumentNumber: 9; SheetNumber: 9; SheetTotal: 32
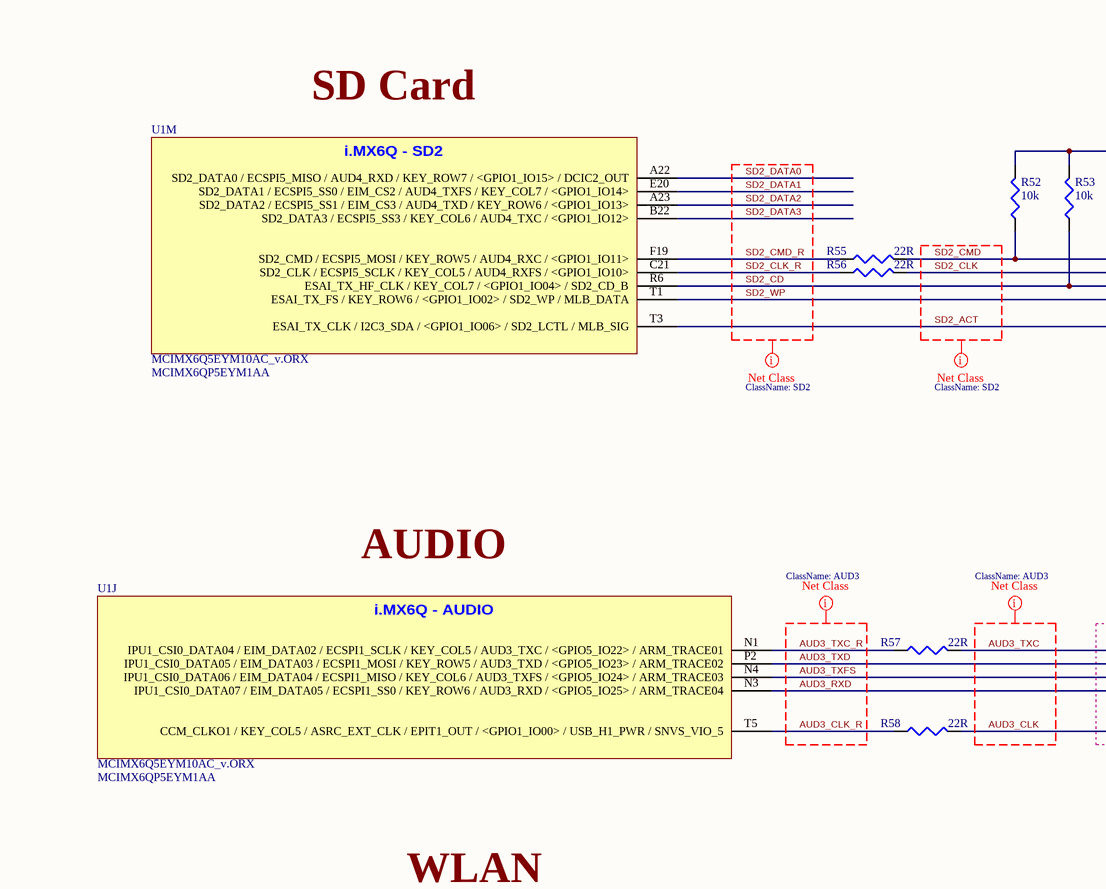
[diagram p23: [09] - CPU - SD, AUDIO, I2C, CAN.SchDoc, top left]
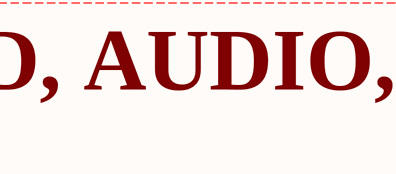
[diagram p24: [09] - CPU - SD, AUDIO, I2C, CAN.SchDoc, top right]
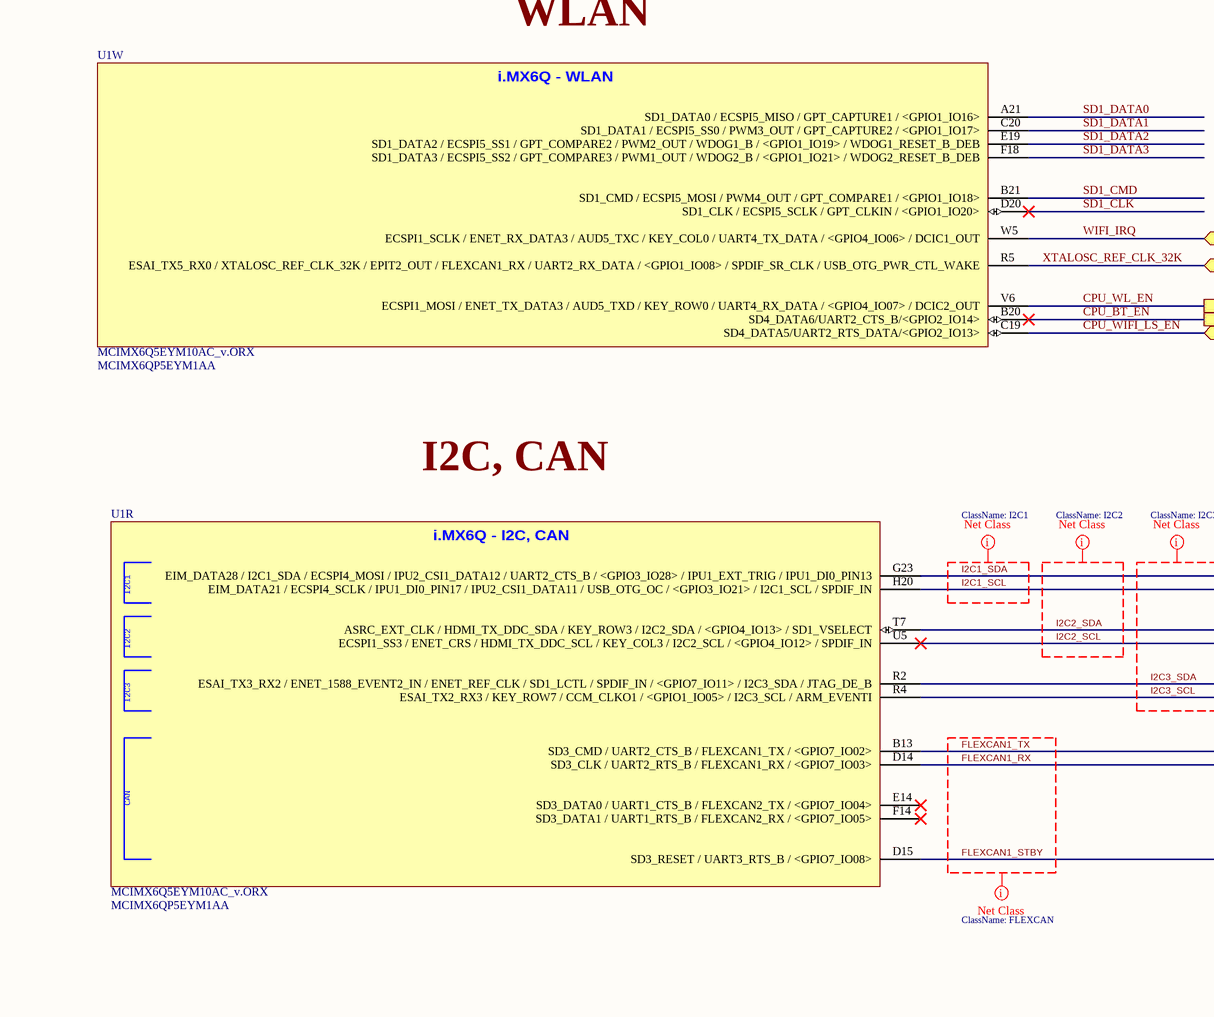
[diagram p25: [09] - CPU - SD, AUDIO, I2C, CAN.SchDoc, bottom left]
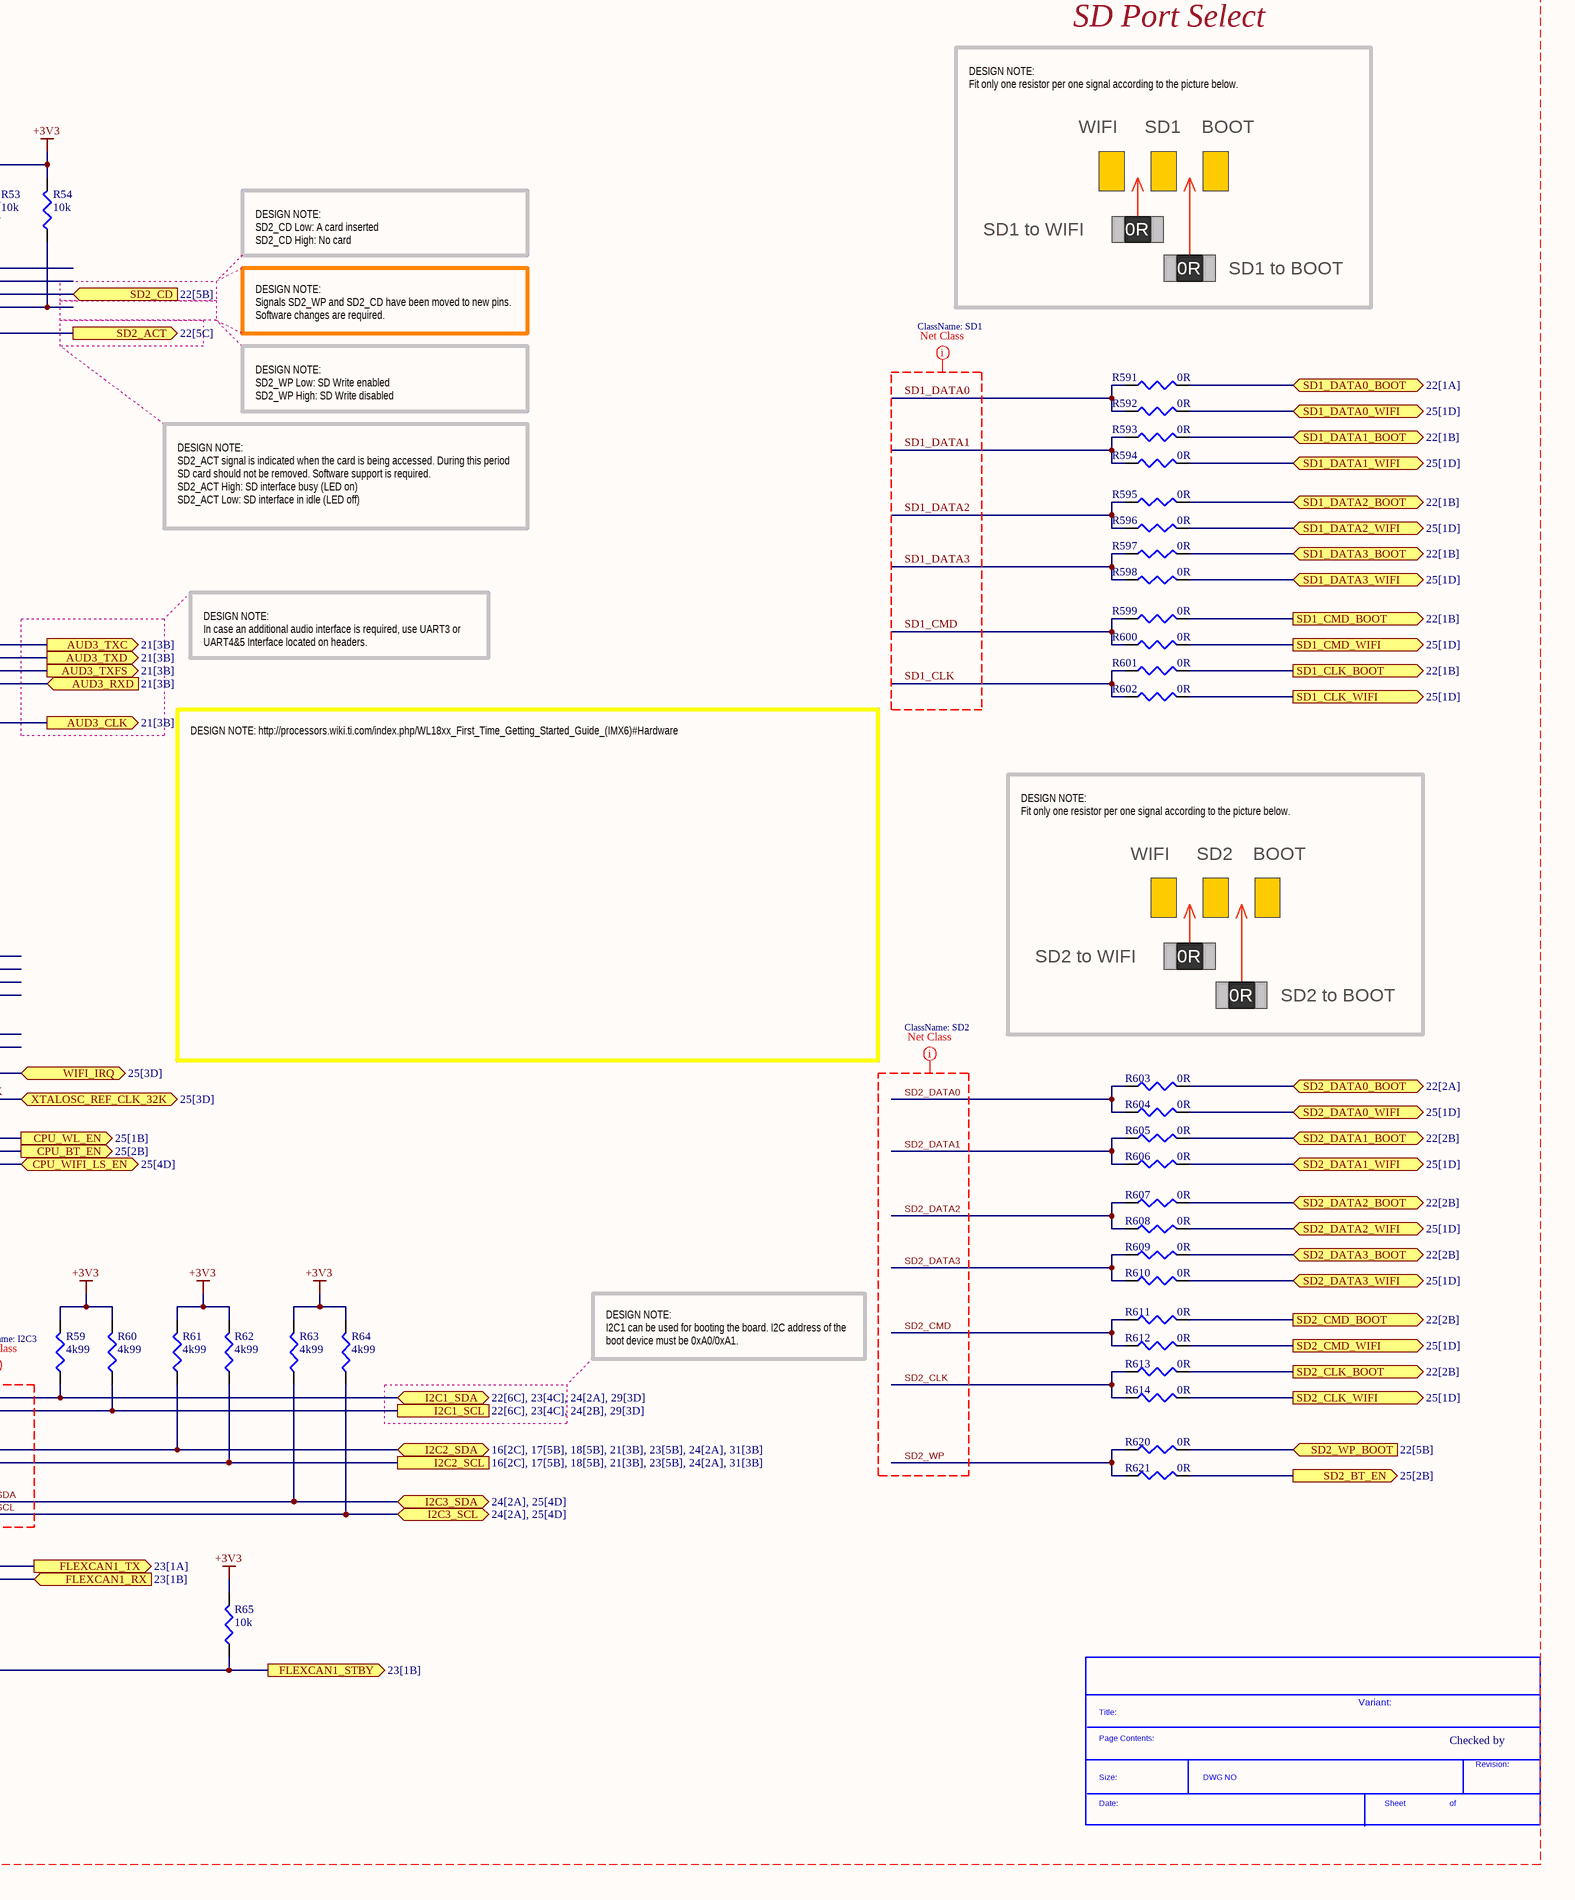
[diagram p26: [09] - CPU - SD, AUDIO, I2C, CAN.SchDoc, bottom right]

### Parts
(Parts that share a designator on the sheet are numbered #1, #2 ... from top to bottom, then left to right.)
*#10  SDTitleBlock  (value not drawn)  (graphical)
R52  10k  [R0402]
R53  10k  [R0402]
R54  10k  [R0402]
R55  22R  [R0402]
R56  22R  [R0402]
R57  22R  [R0402]
R58  22R  [R0402]
R59  4k99  [R0402]
R60  4k99  [R0402]
R61  4k99  [R0402]
R62  4k99  [R0402]
R63  4k99  [R0402]
R64  4k99  [R0402]
R65  10k  [R0402]
R591  0R  [R0402]
R592  0R  [R0402]
R593  0R  [R0402]
R594  0R  [R0402]
R595  0R  [R0402]
R596  0R  [R0402]
R597  0R  [R0402]
R598  0R  [R0402]
R599  0R  [R0402]
R600  0R  [R0402]
R601  0R  [R0402]
R602  0R  [R0402]
R603  0R  [R0402]
R604  0R  [R0402]
R605  0R  [R0402]
R606  0R  [R0402]
R607  0R  [R0402]
R608  0R  [R0402]
R609  0R  [R0402]
R610  0R  [R0402]
R611  0R  [R0402]
R612  0R  [R0402]
R613  0R  [R0402]
R614  0R  [R0402]
R620  0R  [R0402]
R621  0R  [R0402]
U1  MCIMX6Q5EYM10AC_v.ORX  Supplier Part Number 2: MCIMX6QP5EYM1AA  [PBGA624]  (parts J,M,R,W of 23)

### Ports
AUD3_CLK (out, see 21[3B]), AUD3_RXD (in, see 21[3B]), AUD3_TXC (out, see 21[3B]), AUD3_TXD (out, see 21[3B]), AUD3_TXFS (out, see 21[3B]), CPU_BT_EN (out, see 25[2B]), CPU_WIFI_LS_EN (bidir, see 25[4D]), CPU_WL_EN (out, see 25[1B]), FLEXCAN1_RX (in, see 23[1B]), FLEXCAN1_STBY (out, see 23[1B]), FLEXCAN1_TX (out, see 23[1A]), I2C1_SCL (see 22[6C], 23[4C], 24[2B], 29[3D]), I2C1_SDA (bidir, see 22[6C], 23[4C], 24[2A], 29[3D]), I2C2_SCL (see 16[2C], 17[5B], 18[5B], 21[3B], 23[5B], 24[2A], 31[3B]), I2C2_SDA (bidir, see 16[2C], 17[5B], 18[5B], 21[3B], 23[5B], 24[2A], 31[3B]), I2C3_SCL (bidir, see 24[2A], 25[4D]), I2C3_SDA (bidir, see 24[2A], 25[4D]), SD1_CLK_BOOT (out, see 22[1B]), SD1_CLK_WIFI (out, see 25[1D]), SD1_CMD_BOOT (out, see 22[1B]), SD1_CMD_WIFI (out, see 25[1D]), SD1_DATA0_BOOT (bidir, see 22[1A]), SD1_DATA0_WIFI (bidir, see 25[1D]), SD1_DATA1_BOOT (bidir, see 22[1B]), SD1_DATA1_WIFI (bidir, see 25[1D]), SD1_DATA2_BOOT (bidir, see 22[1B]), SD1_DATA2_WIFI (bidir, see 25[1D]), SD1_DATA3_BOOT (bidir, see 22[1B]), SD1_DATA3_WIFI (bidir, see 25[1D]), SD2_ACT (out, see 22[5C]), SD2_BT_EN (out, see 25[2B]), SD2_CD (in, see 22[5B]), SD2_CLK_BOOT (out, see 22[2B]), SD2_CLK_WIFI (out, see 25[1D]), SD2_CMD_BOOT (out, see 22[2B]), SD2_CMD_WIFI (out, see 25[1D]), SD2_DATA0_BOOT (bidir, see 22[2A]), SD2_DATA0_WIFI (bidir, see 25[1D]), SD2_DATA1_BOOT (bidir, see 22[2B]), SD2_DATA1_WIFI (bidir, see 25[1D]), SD2_DATA2_BOOT (bidir, see 22[2B]), SD2_DATA2_WIFI (bidir, see 25[1D]), SD2_DATA3_BOOT (bidir, see 22[2B]), SD2_DATA3_WIFI (bidir, see 25[1D]), SD2_WP_BOOT (in, see 22[5B]), WIFI_IRQ (bidir, see 25[3D]), XTALOSC_REF_CLK_32K (bidir, see 25[3D])

### Nets
+3V3: R52.2 R53.2 R54.2 R59.2 R60.2 R61.2 R62.2 R63.2 R64.2 R65.2
AUD3_CLK: R58.2 ; port AUD3_CLK
AUD3_CLK_R: R58.1 U1.T5(CCM_CLKO1_/_KEY_COL5_/_ASRC_EXT_CLK_/_EPIT1_OUT_/_<GPIO1_IO00>_/_USB_H1_PWR_/_SNVS_VIO_5)
AUD3_RXD: U1.N3(IPU1_CSI0_DATA07_/_EIM_DATA05_/_ECSPI1_SS0_/_KEY_ROW6_/_AUD3_RXD_/_<GPIO5_IO25>_/_ARM_TRACE04) ; port AUD3_RXD
AUD3_TXC: R57.2 ; port AUD3_TXC
AUD3_TXC_R: R57.1 U1.N1(IPU1_CSI0_DATA04_/_EIM_DATA02_/_ECSPI1_SCLK_/_KEY_COL5_/_AUD3_TXC_/_<GPIO5_IO22>_/_ARM_TRACE01)
AUD3_TXD: U1.P2(IPU1_CSI0_DATA05_/_EIM_DATA03_/_ECSPI1_MOSI_/_KEY_ROW5_/_AUD3_TXD_/_<GPIO5_IO23>_/_ARM_TRACE02) ; port AUD3_TXD
AUD3_TXFS: U1.N4(IPU1_CSI0_DATA06_/_EIM_DATA04_/_ECSPI1_MISO_/_KEY_COL6_/_AUD3_TXFS_/_<GPIO5_IO24>_/_ARM_TRACE03) ; port AUD3_TXFS
CPU_BT_EN: U1.B20(SD4_DATA6/UART2_CTS_B/<GPIO2_IO14>) ; port CPU_BT_EN
CPU_WIFI_LS_EN: U1.C19(SD4_DATA5/UART2_RTS_DATA/<GPIO2_IO13>) ; port CPU_WIFI_LS_EN
CPU_WL_EN: U1.V6(ECSPI1_MOSI_/_ENET_TX_DATA3_/_AUD5_TXD_/_KEY_ROW0_/_UART4_RX_DATA_/_<GPIO4_IO07>_/_DCIC2_OUT) ; port CPU_WL_EN
FLEXCAN1_RX: U1.D14(SD3_CLK_/_UART2_RTS_B_/_FLEXCAN1_RX_/_<GPIO7_IO03>) ; port FLEXCAN1_RX
FLEXCAN1_STBY: R65.1 U1.D15(SD3_RESET_/_UART3_RTS_B_/_<GPIO7_IO08>) ; port FLEXCAN1_STBY
FLEXCAN1_TX: U1.B13(SD3_CMD_/_UART2_CTS_B_/_FLEXCAN1_TX_/_<GPIO7_IO02>) ; port FLEXCAN1_TX
I2C1_SCL: R60.1 U1.H20(EIM_DATA21_/_ECSPI4_SCLK_/_IPU1_DI0_PIN17_/_IPU2_CSI1_DATA11_/_USB_OTG_OC_/_<GPIO3_IO21>_/_I2C1_SCL_/_SPDIF_IN) ; port I2C1_SCL
I2C1_SDA: R59.1 U1.G23(EIM_DATA28_/_I2C1_SDA_/_ECSPI4_MOSI_/_IPU2_CSI1_DATA12_/_UART2_CTS_B_/_<GPIO3_IO28>_/_IPU1_EXT_TRIG_/_IPU1_DI0_PIN13) ; port I2C1_SDA
I2C2_SCL: R62.1 U1.U5(ECSPI1_SS3_/_ENET_CRS_/_HDMI_TX_DDC_SCL_/_KEY_COL3_/_I2C2_SCL_/_<GPIO4_IO12>_/_SPDIF_IN) ; port I2C2_SCL
I2C2_SDA: R61.1 U1.T7(ASRC_EXT_CLK_/_HDMI_TX_DDC_SDA_/_KEY_ROW3_/_I2C2_SDA_/_<GPIO4_IO13>_/_SD1_VSELECT) ; port I2C2_SDA
I2C3_SCL: R64.1 U1.R4(ESAI_TX2_RX3_/_KEY_ROW7_/_CCM_CLKO1_/_<GPIO1_IO05>_/_I2C3_SCL_/_ARM_EVENTI) ; port I2C3_SCL
I2C3_SDA: R63.1 U1.R2(ESAI_TX3_RX2_/_ENET_1588_EVENT2_IN_/_ENET_REF_CLK_/_SD1_LCTL_/_SPDIF_IN_/_<GPIO7_IO11>_/_I2C3_SDA_/_JTAG_DE_B) ; port I2C3_SDA
SD1_CLK: R601.2 R602.2 U1.D20(SD1_CLK_/_ECSPI5_SCLK_/_GPT_CLKIN_/_<GPIO1_IO20>)
SD1_CLK_BOOT: R601.1 ; port SD1_CLK_BOOT
SD1_CLK_WIFI: R602.1 ; port SD1_CLK_WIFI
SD1_CMD: R599.2 R600.2 U1.B21(SD1_CMD_/_ECSPI5_MOSI_/_PWM4_OUT_/_GPT_COMPARE1_/_<GPIO1_IO18>)
SD1_CMD_BOOT: R599.1 ; port SD1_CMD_BOOT
SD1_CMD_WIFI: R600.1 ; port SD1_CMD_WIFI
SD1_DATA0: R591.2 R592.2 U1.A21(SD1_DATA0_/_ECSPI5_MISO_/_GPT_CAPTURE1_/_<GPIO1_IO16>)
SD1_DATA0_BOOT: R591.1 ; port SD1_DATA0_BOOT
SD1_DATA0_WIFI: R592.1 ; port SD1_DATA0_WIFI
SD1_DATA1: R593.2 R594.2 U1.C20(SD1_DATA1_/_ECSPI5_SS0_/_PWM3_OUT_/_GPT_CAPTURE2_/_<GPIO1_IO17>)
SD1_DATA1_BOOT: R593.1 ; port SD1_DATA1_BOOT
SD1_DATA1_WIFI: R594.1 ; port SD1_DATA1_WIFI
SD1_DATA2: R595.2 R596.2 U1.E19(SD1_DATA2_/_ECSPI5_SS1_/_GPT_COMPARE2_/_PWM2_OUT_/_WDOG1_B_/_<GPIO1_IO19>_/_WDOG1_RESET_B_DEB)
SD1_DATA2_BOOT: R595.1 ; port SD1_DATA2_BOOT
SD1_DATA2_WIFI: R596.1 ; port SD1_DATA2_WIFI
SD1_DATA3: R597.2 R598.2 U1.F18(SD1_DATA3_/_ECSPI5_SS2_/_GPT_COMPARE3_/_PWM1_OUT_/_WDOG2_B_/_<GPIO1_IO21>_/_WDOG2_RESET_B_DEB)
SD1_DATA3_BOOT: R597.1 ; port SD1_DATA3_BOOT
SD1_DATA3_WIFI: R598.1 ; port SD1_DATA3_WIFI
SD2_ACT: U1.T3(ESAI_TX_CLK_/_I2C3_SDA_/_<GPIO1_IO06>_/_SD2_LCTL_/_MLB_SIG) ; port SD2_ACT
SD2_BT_EN: R621.1 ; port SD2_BT_EN
SD2_CD: R53.1 U1.R6(ESAI_TX_HF_CLK_/_KEY_COL7_/_<GPIO1_IO04>_/_SD2_CD_B) ; port SD2_CD
SD2_CLK: R56.2 R613.2 R614.2
SD2_CLK_BOOT: R613.1 ; port SD2_CLK_BOOT
SD2_CLK_R: R56.1 U1.C21(SD2_CLK_/_ECSPI5_SCLK_/_KEY_COL5_/_AUD4_RXFS_/_<GPIO1_IO10>)
SD2_CLK_WIFI: R614.1 ; port SD2_CLK_WIFI
SD2_CMD: R52.1 R55.2 R611.2 R612.2
SD2_CMD_BOOT: R611.1 ; port SD2_CMD_BOOT
SD2_CMD_R: R55.1 U1.F19(SD2_CMD_/_ECSPI5_MOSI_/_KEY_ROW5_/_AUD4_RXC_/_<GPIO1_IO11>)
SD2_CMD_WIFI: R612.1 ; port SD2_CMD_WIFI
SD2_DATA0: R603.2 R604.2 U1.A22(SD2_DATA0_/_ECSPI5_MISO_/_AUD4_RXD_/_KEY_ROW7_/_<GPIO1_IO15>_/_DCIC2_OUT)
SD2_DATA0_BOOT: R603.1 ; port SD2_DATA0_BOOT
SD2_DATA0_WIFI: R604.1 ; port SD2_DATA0_WIFI
SD2_DATA1: R605.2 R606.2 U1.E20(SD2_DATA1_/_ECSPI5_SS0_/_EIM_CS2_/_AUD4_TXFS_/_KEY_COL7_/_<GPIO1_IO14>)
SD2_DATA1_BOOT: R605.1 ; port SD2_DATA1_BOOT
SD2_DATA1_WIFI: R606.1 ; port SD2_DATA1_WIFI
SD2_DATA2: R607.2 R608.2 U1.A23(SD2_DATA2_/_ECSPI5_SS1_/_EIM_CS3_/_AUD4_TXD_/_KEY_ROW6_/_<GPIO1_IO13>)
SD2_DATA2_BOOT: R607.1 ; port SD2_DATA2_BOOT
SD2_DATA2_WIFI: R608.1 ; port SD2_DATA2_WIFI
SD2_DATA3: R609.2 R610.2 U1.B22(SD2_DATA3_/_ECSPI5_SS3_/_KEY_COL6_/_AUD4_TXC_/_<GPIO1_IO12>)
SD2_DATA3_BOOT: R609.1 ; port SD2_DATA3_BOOT
SD2_DATA3_WIFI: R610.1 ; port SD2_DATA3_WIFI
SD2_WP: R54.1 R620.2 R621.2 U1.T1(ESAI_TX_FS_/_KEY_ROW6_/_<GPIO1_IO02>_/_SD2_WP_/_MLB_DATA)
SD2_WP_BOOT: R620.1 ; port SD2_WP_BOOT
WIFI_IRQ: U1.W5(ECSPI1_SCLK_/_ENET_RX_DATA3_/_AUD5_TXC_/_KEY_COL0_/_UART4_TX_DATA_/_<GPIO4_IO06>_/_DCIC1_OUT) ; port WIFI_IRQ
XTALOSC_REF_CLK_32K: U1.R5(ESAI_TX5_RX0_/_XTALOSC_REF_CLK_32K_/_EPIT2_OUT_/_FLEXCAN1_RX_/_UART2_RX_DATA_/_<GPIO1_IO08>_/_SPDIF_SR_CLK_/_USB_OTG_PWR_CTL_WAKE) ; port XTALOSC_REF_CLK_32K

Not connected (* = marked no-connect by the designer): U1 E14(SD3_DATA0_/_UART1_CTS_B_/_FLEXCAN2_TX_/_<GPIO7_IO04>)* F14(SD3_DATA1_/_UART1_RTS_B_/_FLEXCAN2_RX_/_<GPIO7_IO05>)*

### Layout directives
net class AUD3: AUD3_CLK, AUD3_CLK_R, AUD3_RXD, AUD3_TXC, AUD3_TXC_R, AUD3_TXD, AUD3_TXFS
net class FLEXCAN: FLEXCAN1_RX, FLEXCAN1_STBY, FLEXCAN1_TX
net class I2C1: I2C1_SCL, I2C1_SDA
net class I2C2: I2C2_SCL, I2C2_SDA
net class I2C3: I2C3_SCL, I2C3_SDA
net class SD2: SD2_ACT, SD2_CD, SD2_CLK, SD2_CLK_R, SD2_CMD, SD2_CMD_R, SD2_DATA0, SD2_DATA1, SD2_DATA2, SD2_DATA3, SD2_WP
net class [09] - CPU - SD/AUDIO/I2C/CAN: +3V3, AUD3_CLK, AUD3_CLK_R, AUD3_RXD, AUD3_TXC, AUD3_TXC_R, AUD3_TXD, AUD3_TXFS, CPU_BT_EN, CPU_WIFI_LS_EN, CPU_WL_EN, FLEXCAN1_RX, FLEXCAN1_STBY, FLEXCAN1_TX, I2C1_SCL, I2C1_SDA, I2C2_SCL, I2C2_SDA, I2C3_SCL, I2C3_SDA, SD1_CLK, SD1_CMD, SD1_DATA0, SD1_DATA1, SD1_DATA2, SD1_DATA3, SD2_ACT, SD2_CD, SD2_CLK, SD2_CLK_R, SD2_CMD, SD2_CMD_R, SD2_DATA0, SD2_DATA1, SD2_DATA2, SD2_DATA3, SD2_WP, WIFI_IRQ, XTALOSC_REF_CLK_32K
net class SD1: SD1_CLK, SD1_CMD, SD1_DATA0, SD1_DATA1, SD1_DATA2, SD1_DATA3

### Notes on the sheet
- CPU - SD CARD, AUDIO, I2C, CAN
- SD Port Select
- SD Card
- DESIGN NOTE:
  Fit only one resistor per one signal according to the picture below.
- WIFI
- SD1
- BOOT
- DESIGN NOTE:
  SD2_CD Low: A card inserted
  SD2_CD High: No card
- SD1 to WIFI
- 0R
- SD1 to BOOT
- DESIGN NOTE:
  Signals SD2_WP and SD2_CD have been moved to new pins. Software changes are required.
- DESIGN NOTE:
  SD2_WP Low: SD Write enabled
  SD2_WP High: SD Write disabled
- DESIGN NOTE:
  SD2_ACT signal is indicated when the card is being accessed. During this period SD card should not be removed. Software support is required.
  SD2_ACT High: SD interface busy (LED on)
  SD2_ACT Low: SD interface in idle (LED off)
- AUDIO
- DESIGN NOTE:
  In case an additional audio interface is required, use UART3 or UART4&5 Interface located on headers.
- DESIGN NOTE: http://processors.wiki.ti.com/index.php/WL18xx_First_Time_Getting_Started_Guide_(IMX6)#Hardware
- WLAN
- SD2
- SD2 to WIFI
- SD2 to BOOT
- I2C, CAN
- DESIGN NOTE:
  I2C1 can be used for booting the board. I2C address of the boot device must be 0xA0/0xA1.
- Variant:
- Checked by
- (in symbol MCIMX6Q5EYM10AC_v.ORX, part J) i.MX6Q - AUDIO
- (in symbol MCIMX6Q5EYM10AC_v.ORX, part M) i.MX6Q - SD2
- (in symbol MCIMX6Q5EYM10AC_v.ORX, part R) i.MX6Q - I2C, CAN; I2C1; I2C2; I2C3; CAN
- (in symbol MCIMX6Q5EYM10AC_v.ORX, part W) i.MX6Q - WLAN
- (in symbol SDTitleBlock) Title:; Page Contents:; Revision:; Size:; DWG NO; Date:; Sheet; of

### Library data of the parts
R52-R54 R65 = RC0402FR-0710KL: as R45 on sheet [08] - CPU - SPI, UART; Category: Resistors; Supplier Part Number: 311-10.0KLRCT-ND; Manufacturer Part Number: RC0402FR-0710KL; Package / Case: 0402 (1005 Metric); Price 1k [$]: 0.01421; Resistance (Ohms): 10K; Tolerance: ±1%; Value: 10k; .Checked SCH: used; Supplier: Digikey; Supplier 1: Digi-Key; Supplier Part Number 1: 311-10.0KLRCT-ND; RoHS: RoHS Compliant; Stock 1: 2916495; Pricing 1: 10=0.014, 50=0.0104, 100=0.0079, 250=0.00584, 500=0.00432, 1000=0.00288 (USD); Composition: Thick Film; Features: -; Size / Dimension: 0.039" L x 0.020" W (1.00mm x 0.50mm); Height: 0.016" (0.40mm); Number of Terminations: 2; Packaging: Cut Tape (CT); ComponentLink1URL: http://www.yageo.com/documents/recent/PYu-RC0402_51_RoHS_L_6.pdf; ComponentLink1Description: http://www.yageo.com/documents/recent/PYu-RC0402_51_RoHS_L_6.pdf
R55-R58 = RC0402FR-0722RL: as R42 on sheet [08] - CPU - SPI, UART; Category: Resistors; Supplier Part Number: 311-22.0LRCT-ND; Manufacturer Part Number: RC0402FR-0722RL; Package / Case: 0402 (1005 Metric); Price 1k [$]: 0.01421; Tolerance: ±1%; Value: 22R; .Checked SCH: used; Supplier: Digikey; Supplier 1: Digi-Key; Supplier Part Number 1: 311-22.0LRCT-ND; RoHS: RoHS Compliant; Stock 1: 943800; Pricing 1: 10=0.014, 50=0.0104, 100=0.0079, 250=0.00584, 500=0.00432, 1000=0.00288 (USD); Composition: Thick Film; Features: -; Size / Dimension: 0.039" L x 0.020" W (1.00mm x 0.50mm); Height: 0.016" (0.40mm); Number of Terminations: 2; Packaging: Cut Tape (CT); ComponentLink1URL: http://www.yageo.com/documents/recent/PYu-RC0402_51_RoHS_L_6.pdf; ComponentLink1Description: http://www.yageo.com/documents/recent/PYu-RC0402_51_RoHS_L_6.pdf
R59-R64 = RMCF0402FT4K99: as R48 on sheet [10] - CPU - GPIO, PWM, LEDS, BUTTONS; Category: Resistors; Supplier Part Number: RMCF0402FT4K99CT-ND; Manufacturer Part Number: RMCF0402FT4K99; Package / Case: 0402 (1005 Metric); Price 1k [$]: 0.00384; Resistance (Ohms): 4.99K; Tolerance: ±1%; Value: 4k99; .Checked SCH: used; Supplier: Digikey; Supplier 1: Digi-Key; Supplier Part Number 1: RMCF0402FT4K99CT-ND; RoHS: RoHS Compliant; Stock 1: 48509; Pricing 1: 1=0.04, 10=0.025, 50=0.0138, 100=0.0105, 250=0.0078, 500=0.00576, 1000=0.00384 (USD); Composition: Thick Film; Features: -; Size / Dimension: 0.039" L x 0.020" W (1.00mm x 0.50mm); Height: 0.016" (0.40mm); Number of Terminations: 2; Packaging: Cut Tape (CT); ComponentLink1URL: http://www.seielect.com/Catalog/SEI-RMCF.pdf; ComponentLink1Description: http://www.seielect.com/Catalog/SEI-RMCF.pdf
R591-R614 R620 R621 = RC0402JR-070RL: RES 0.0 OHM 1/16W 0402 SMD; Manufacturer: Yageo; Resistance (Ohms): 0.0; Power (Watts): 0.063W, 1/16W; Tolerance: Jumper; .Checked PCB: used; Category: Resistors; Manufacturer Part Number: RC0402JR-070RL; Package / Case: 0402 (1005 Metric); Price 1k [$]: 0.01389; Value: 0R; .Checked SCH: used; Supplier Part Number: 311-0.0JRCT-ND; Supplier: Digikey; Supplier 1: Digi-Key; Supplier Part Number 1: 311-0.0JRCT-ND; RoHS: RoHS Compliant; Stock 1: 1106330; Pricing 1: 10=0.012, 50=0.009, 100=0.0069, 250=0.00512, 500=0.0038, 1000=0.00253 (USD); Composition: Thick Film; Features: -; Temperature Coefficient: -; Size / Dimension: 0.039" L x 0.020" W (1.00mm x 0.50mm); Height: 0.016" (0.40mm); Number of Terminations: 2; Packaging: Cut Tape (CT); ComponentLink1URL: http://www.yageo.com/documents/recent/PYu-RC0402_51_RoHS_L_6.pdf; ComponentLink1Description: http://www.yageo.com/documents/recent/PYu-RC0402_51_RoHS_L_6.pdf
U1 = MCIMX6Q5EYM10AC_v.ORX: as U1 on sheet [08] - CPU - SPI, UART; Supplier 1: Digi-Key; Manufacturer Part Number: MCIMX6Q5EYM10AC; RoHS: RoHS Compliant; Category: Integrated Circuits (ICs); Stock 1: 0; Pricing 1: 1=54.98, 10=51.922, 25=48.868, 100=30.5424 (USD); Program Memory Size: -; EEPROM Size: -; Data Converters: -; Operating Temperature: -20°C ~ 105°C; Package / Case: 624-FBGA, FCBGA; Packaging: Tray; ComponentLink1URL: http://cache.freescale.com/files/32bit/doc/data_sheet/IMX6DQCEC.pdf; ComponentLink1Description: Data Sheet; Supplier Part Number 1: MCIMX6Q5EYM10AC-ND; .Checked SCH: used; ComponentLink2Description: User Guide; ComponentLink2URL: file:///C:/Users/mbeach/Downloads/i.MX_Linux_User's_Guide.pdf; Supplier 2: Arrow